# EAGLE design hover_controller_v2 (EAGLE 8.2.1)
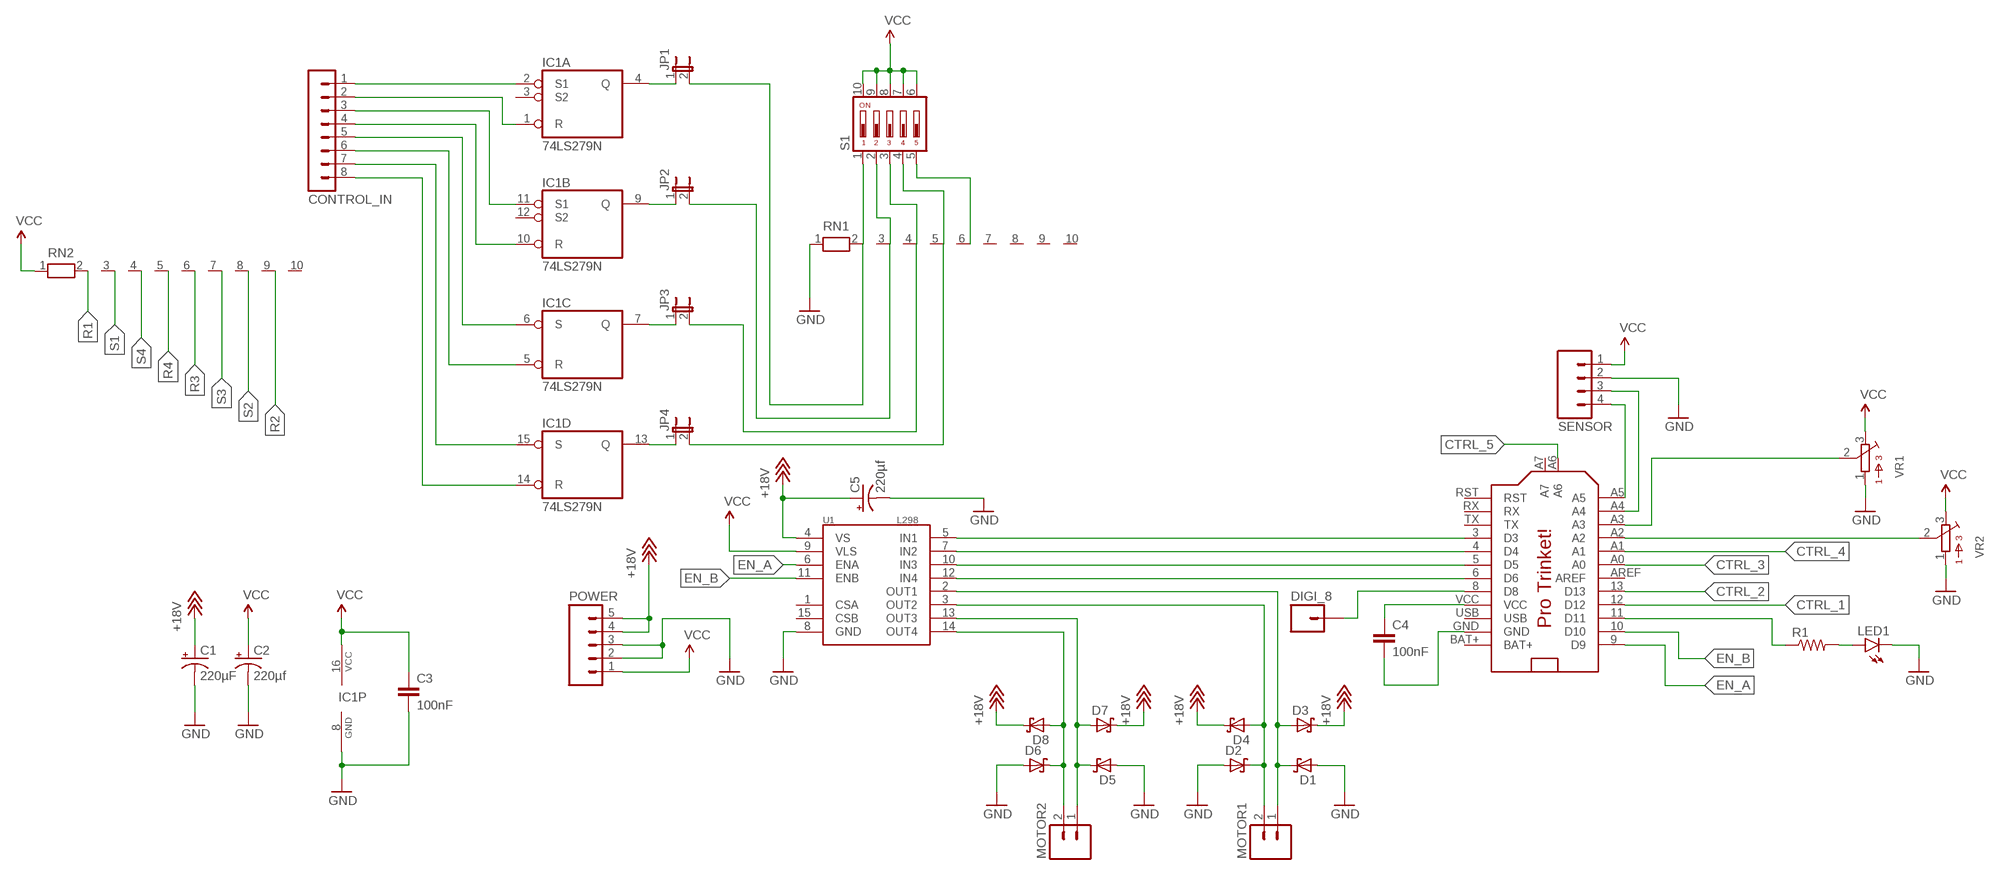
[diagram p0: schematic, sheet 1]

## Parts
C1  220µF  CAP_POLPTH2  [CPOL-RADIAL-10UF-25V]
C2  220µf  CAP_POLPTH2  [CPOL-RADIAL-10UF-25V]
C3  100nF  CAPPTH1  [CAP-PTH-5MM]
C4  100nF  CAPPTH1  [CAP-PTH-5MM]
C5  220µf  CAP_POLPTH2  [CPOL-RADIAL-10UF-25V]
CONTROL_IN  MA08-1  [MA08-1]
D1  SCHOTTKY-DIODEDO35-7  [DO35-7]
D2  SCHOTTKY-DIODEDO35-7  [DO35-7]
D3  SCHOTTKY-DIODEDO35-7  [DO35-7]
D4  SCHOTTKY-DIODEDO35-7  [DO35-7]
D5  SCHOTTKY-DIODEDO35-7  [DO35-7]
D6  SCHOTTKY-DIODEDO35-7  [DO35-7]
D7  SCHOTTKY-DIODEDO35-7  [DO35-7]
D8  SCHOTTKY-DIODEDO35-7  [DO35-7]
DIGI_8  M01PTH  [1X01]
IC1  74LS279N  [DIL16]
JP1  JUMPER-2PTH  [1X02]
JP2  JUMPER-2PTH  [1X02]
JP3  JUMPER-2PTH  [1X02]
JP4  JUMPER-2PTH  [1X02]
LED1  LED-3MM-NO_SILK  [LED3MM-NS]
MOTOR1  M02PTH  [1X02]
MOTOR2  M02PTH  [1X02]
POWER  M05JST-VERT  [JST-5-PTH-VERT]
R1  RESISTORPTH-1/4W  [AXIAL-0.4]
RN1  RN09  [RN-10]
RN2  RN09  [RN-10]
S1  DIP05YL  [DIP05YL]
SENSOR  M04PTH  [1X04]
U1  L298  [MULTIWATT15]
U$1  PRO_TRINKET  [PROTRINKET]
VR1  BOURNS_3362P_TRIMMERP  [BOURNS_3362P_TRIMMER]
VR2  BOURNS_3362P_TRIMMERP  [BOURNS_3362P_TRIMMER]

## Nets
+18V: C1.1(+) C5.1(+) D3.C D4.C D7.C D8.C POWER.4 POWER.5 U1.4(VS)
CTRL_1: JP1.2 RN1.2 S1.1 U$1.12(D12)
CTRL_2: JP2.2 RN1.3 S1.2 U$1.13(D13)
CTRL_3: JP3.2 RN1.4 S1.3 U$1.A0
CTRL_4: JP4.2 RN1.5 S1.4 U$1.A1
CTRL_5: RN1.6 S1.5 U$1.A6
EN_A: U1.6(ENA) U$1.9(D9)
EN_B: U1.11(ENB) U$1.10(D10)
GND: C1.2(-) C2.2(-) C3.2 C5.2(-) D1.A D2.A D5.A D6.A IC1.8(P:GND) LED1.K(C) POWER.2 POWER.3 RN1.1 SENSOR.2 U1.8(GND) VR1.1 VR2.1
N$1: IC1.4(A:Q) JP1.1
N$2: IC1.9(B:Q) JP2.1
N$3: IC1.7(C:Q) JP3.1
N$4: IC1.13(D:Q) JP4.1
N$5: U$1.A2 VR2.2
N$13: LED1.A R1.P$2
N$14: R1.P$1 U$1.11(D11)
N$15: DIGI_8.1 U$1.8(D8)
N$17: C4.1 U$1.VCC
N$18: U$1.A3 VR1.2
N$20: SENSOR.4 U$1.A5
N$21: SENSOR.3 U$1.A4
N$22: U1.5(IN1) U$1.3(D3)
N$23: U1.7(IN2) U$1.4(D4)
N$24: U1.10(IN3) U$1.5(D5)
N$25: U1.12(IN4) U$1.6(D6)
N$26: D1.C D3.A MOTOR1.1 U1.2(OUT1)
N$27: D2.C D4.A MOTOR1.2 U1.3(OUT2)
N$28: D5.C D7.A MOTOR2.1 U1.13(OUT3)
N$29: D6.C D8.A MOTOR2.2 U1.14(OUT4)
N$30: C4.2 U$1.GND
R1: CONTROL_IN.2 IC1.1(A:R) RN2.2
R2: CONTROL_IN.4 IC1.10(B:R) RN2.9
R3: CONTROL_IN.6 IC1.5(C:R) RN2.6
R4: CONTROL_IN.8 IC1.14(D:R) RN2.5
S1: CONTROL_IN.1 IC1.2(A:S1) RN2.3
S2: CONTROL_IN.3 IC1.11(B:S1) RN2.8
S3: CONTROL_IN.5 IC1.6(C:S) RN2.7
S4: CONTROL_IN.7 IC1.15(D:S) RN2.4
VCC: C2.1(+) C3.1 IC1.16(P:VCC) POWER.1 RN2.1 S1.6 S1.7 S1.8 S1.9 S1.10 SENSOR.1 U1.9(VLS) VR1.3 VR2.3
Unconnected: IC1.3(A:S2) IC1.12(B:S2) RN1.7 RN1.8 RN1.9 RN1.10 RN2.10 U1.1(CSA) U1.15(CSB) U$1.A7 U$1.AREF U$1.RST U$1.RX U$1.TX

## Power pins joined to a net without a drawn wire
BAT+: U$1.BAT+
USB: U$1.USB

## Library data of the parts
C1 C2 C5 = SparkFun-Capacitors:CAP_POL: Capacitor Polarized These are standard SMD and PTH capacitors. Normally 10uF, 47uF, and 100uF in electrolytic and tantalum varieties. Always verify the external diameter of the through hole cap, it varies with capacity, voltage, and manufacturer. The EIA devices should be standard.
C3 C4 = SparkFun-Capacitors:CAP: Capacitor Standard 0603 ceramic capacitor, and 0.1" leaded capacitor.
CONTROL_IN = con-lstb:MA08-1: PIN HEADER; OC_FARNELL: unknown; OC_NEWARK: unknown
D1-D8 = adafruit:SCHOTTKY-DIODE: Schottky Diode
DIGI_8 = SparkFun-Connectors:M01: Header 1 Standard 1-pin 0.1" header. Use with straight break away headers (SKU : PRT-00116), right angle break away headers (PRT-00553), swiss pins (PRT-00743), machine pins (PRT-00117), and female headers (PRT-00115).
IC1 = 74xx-us:74*279: Quadruple S-R LATCH
JP1-JP4 = SparkFun-Retired:JUMPER-2: Jumper Basic 0.1" spaced jumper. Use with breakaway headers.
LED1 = SparkFun-LED:LED: LEDs Standard schematic elements and footprints for 5mm, 3mm, 1206, and 0603 sized LEDs. 5mm - Spark Fun Electronics SKU : COM-00529 (and others)
MOTOR1 MOTOR2 = SparkFun-Connectors:M02: Standard 2-pin 0.1" header. Use with - straight break away headers ( PRT-00116) - right angle break away headers (PRT-00553) - swiss pins (PRT-00743) - machine pins (PRT-00117) - female headers (PRT-00115) Molex polarized connector foot print use with: PRT-08233 with associated crimp pins and housings. 2.54_SCREWTERM for use with PRT-10571. 3.5mm Screw Terminal footprints for PRT-08084 5mm Screw Terminal footprints for use with PRT-08432
POWER = SparkFun-Connectors:M05: Header 5 Standard 5-pin 0.1" header. Use with straight break away headers (SKU : PRT-00116), right angle break away headers (PRT-00553), swiss pins (PRT-00743), machine pins (PRT-00117), and female headers (PRT-00115). Molex polarized connector foot print use with SKU : PRT-08230 with associated crimp pins and housings.
R1 = SparkFun-Resistors:RESISTOR: Resistor Basic schematic elements and footprints for 0603, 1206, and PTH resistors.
RN1 RN2 = resistor-net:RN09: RESISTOR NETWORK; OC_FARNELL: unknown; OC_NEWARK: unknown
S1 = switch-dil:DIP05YL: DIL/CODE SWITCH; OC_FARNELL: unknown; OC_NEWARK: unknown
SENSOR = SparkFun-Connectors:M04: Header 4 Standard 4-pin 0.1" header. Use with straight break away headers (SKU : PRT-00116), right angle break away headers (PRT-00553), swiss pins (PRT-00743), machine pins (PRT-00117), and female headers (PRT-00115). Molex polarized connector foot print use with SKU : PRT-08231 with associated crimp pins and housings. 1MM SMD Version SKU: PRT-10208
U1 = SparkFun-PowerIC:L298: L298 Dual Full Bridge Driver
U$1 = adafruit:PRO_TRINKET
VR1 VR2 = MusicThingModular:BOURNS_3362P_TRIMMER: 3362 Series 1/4" Square Trimmer

## Board
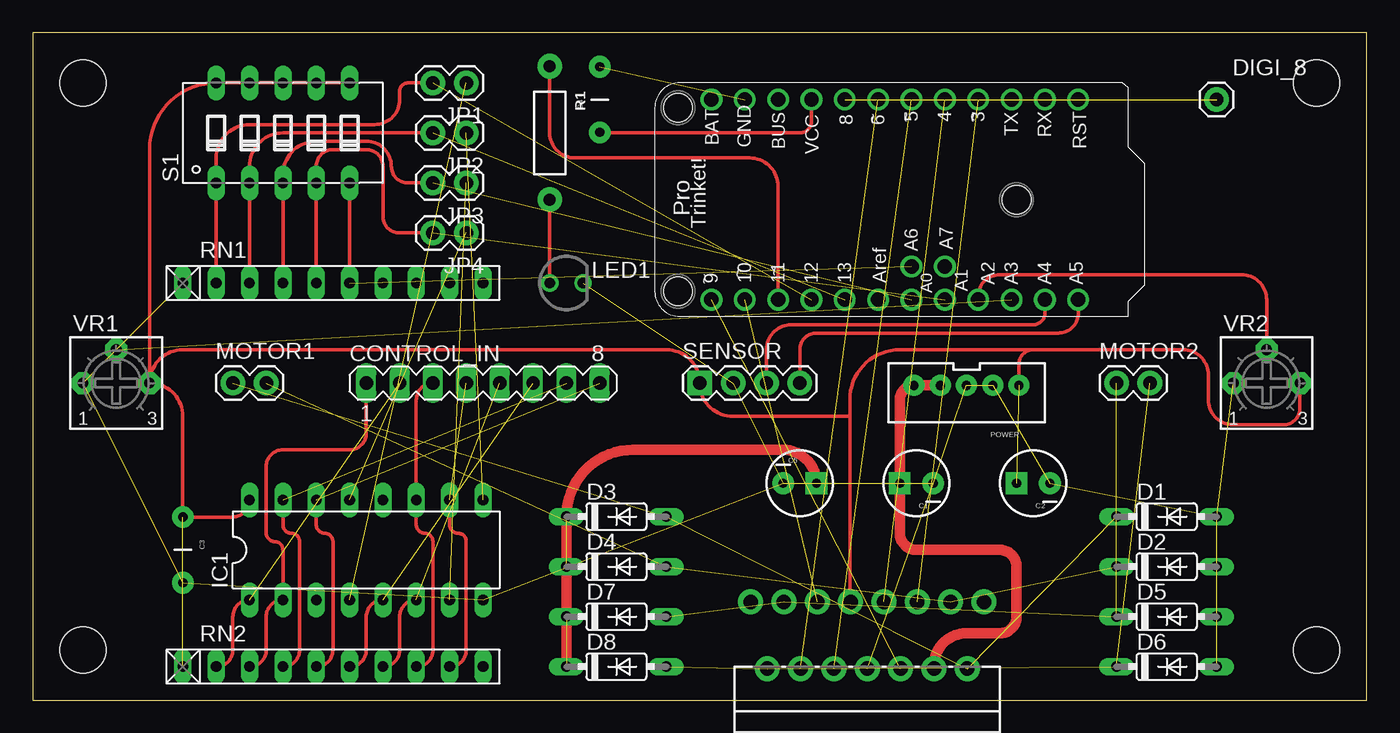
[diagram p1: board, top side]

Size 101.6 x 50.8 mm. Coordinates in mm from the lower left corner, seen from the top.
Outline: 0,0 101.6,0 101.6,50.8 0,50.8 0,0
Copper layers (1*16): Top 0.035mm / dielectric 1.5mm / Bottom 0.035mm
Design rules "default": minimum track width 6mil, minimum drill 0.35mm, track to track 6mil, track to pad 6mil, pad to pad 6mil, via to via 6mil, smd to smd 6mil, copper to edge 40mil, drill to drill 6mil, minimum pad ring 10mil, minimum via ring 8mil, stop-mask expansion 4mil, vias tented up to drill 0mil, thermal gap 10mil
Holes 3.5 mm at 3.81,46.99 3.81,3.81 97.79,3.81 97.79,46.99

### Footprints (pad centres in the part's own frame; a part is rotated, then mirrored left to right if it is on the bottom)
CPOL-RADIAL-10UF-25V = drill 0.7 pad 1.651 square: 1 1.27,0 | drill 0.7 pad 1.651: 2 -1.27,0
CAP-PTH-5MM = drill 0.7 pad 1.651: 1 -2.5,0; 2 2.5,0
MA08-1 = drill 1.016 long: 1 -8.89,0; 2 -6.35,0; 3 -3.81,0; 4 -1.27,0; 5 1.27,0; 6 3.81,0; 7 6.35,0; 8 8.89,0
DO35-7 = drill 0.813 long: A 3.81,0; C -3.81,0
1X01 = drill 1.016 pad 1.88: 1 0,0
DIL16 = drill 0.813 long: 1 -8.89,-3.81; 2 -6.35,-3.81; 3 -3.81,-3.81; 4 -1.27,-3.81; 5 1.27,-3.81; 6 3.81,-3.81; 7 6.35,-3.81; 8 8.89,-3.81; 9 8.89,3.81; 10 6.35,3.81; 11 3.81,3.81; 12 1.27,3.81; 13 -1.27,3.81; 14 -3.81,3.81; 15 -6.35,3.81; 16 -8.89,3.81
1X02 = drill 1.016 pad 1.88: 1 0,0; 2 2.54,0
LED3MM-NS = drill 0.813: A -1.27,0; K 1.27,0
JST-5-PTH-VERT = drill 0.7 pad 1.6: 1 -4,0.18; 2 -2,0.18; 3 0,0.18; 4 2,0.18; 5 4,0.18
AXIAL-0.4 = drill 0.9 pad 1.88: P$1 -5.08,0; P$2 5.08,0
RN-10 = drill 0.813 long: 1 -11.43,0; 2 -8.89,0; 3 -6.35,0; 4 -3.81,0; 5 -1.27,0; 6 1.27,0; 7 3.81,0; 8 6.35,0; 9 8.89,0; 10 11.43,0
DIP05YL = drill 0.813 long: 1 -5.08,-3.81; 2 -2.54,-3.81; 3 0,-3.81; 4 2.54,-3.81; 5 5.08,-3.81; 6 5.08,3.81; 7 2.54,3.81; 8 0,3.81; 9 -2.54,3.81; 10 -5.08,3.81
1X04 = drill 1.016 pad 1.88 square: 1 0,0 | drill 1.016 pad 1.88: 2 2.54,0; 3 5.08,0; 4 7.62,0
MULTIWATT15 = drill 1.1 pad 1.9: 1 -8.95,-2.39; 2 -7.68,2.69; 3 -6.41,-2.39; 4 -5.14,2.69; 5 -3.87,-2.39; 6 -2.6,2.69; 7 -1.33,-2.39; 8 -0.06,2.69; 9 1.21,-2.39; 10 2.48,2.69; 11 3.75,-2.39; 12 5.02,2.69; 13 6.29,-2.39; 14 7.56,2.69; 15 8.83,-2.39
PROTRINKET = drill 1.1: 3 7.62,2.921; 4 7.62,5.461; 5 7.62,8.001; 6 7.62,10.541; 8 7.62,13.081; 9 -7.62,23.241; 10 -7.62,20.701; 11 -7.62,18.161; 12 -7.62,15.621; 13 -7.62,13.081; A0 -7.62,8.001; A1 -7.62,5.461; A2 -7.62,2.921; A3 -7.62,0.381; A4 -7.62,-2.159; A5 -7.62,-4.699; A6 -5.08,8.001; A7 -5.08,5.461; AREF -7.62,10.541; BAT+ 7.62,23.241; GND 7.62,20.701; RST 7.62,-4.699; RX 7.62,-2.159; TX 7.62,0.381; USB 7.62,18.161; VCC 7.62,15.621 | hole 2.2: -6.985,25.781; 6.985,25.781; 0,0
BOURNS_3362P_TRIMMER = drill 0.813 pad 1.676 octagon: 1 -2.54,0; 2 0,2.54; 3 2.54,0

### Placement (x,y rotation side)
C1  67.31,16.51 180 top
C2  76.2,16.51 180 top
C3  11.43,11.43 270 top
C4  43.18,45.72 90 top
C5  58.42,16.51 0 top
CONTROL_IN  34.29,24.13 0 top
D1  86.36,13.97 0 top
D2  86.36,10.16 0 top
D3  44.45,13.97 0 top
D4  44.45,10.16 0 top
D5  86.36,6.35 0 top
D6  86.36,2.54 0 top
D7  44.45,6.35 0 top
D8  44.45,2.54 0 top
DIGI_8  90.17,45.72 0 top
IC1  25.4,11.43 0 top
JP1  33.02,46.99 180 top
JP2  33.02,43.18 180 top
JP3  33.02,39.37 180 top
JP4  33.02,35.56 180 top
LED1  40.64,31.75 0 top
MOTOR1  15.24,24.13 0 top
MOTOR2  82.55,24.13 0 top
POWER  71.12,24.13 180 top
R1  39.37,43.18 270 top
RN1  22.86,31.75 0 top
RN2  22.86,2.54 0 top
S1  19.05,43.18 0 top
SENSOR  50.8,24.13 0 top
U1  63.5,5.08 180 top
U$1  74.93,38.1 90 top
VR1  6.35,24.13 0 top
VR2  93.98,24.13 0 top

### Tracks (layer width: path | path; a pad name or v marks a point on that pad's centre or on a via)
+18V  (3 unrouted)
  Top 0.61: U1.4 68.64,2.6
  Top 0.813: D8.C D3.C arc-90 45.72,19.05 57.15,19.05 arc-90 C5.1 | POWER.4 POWER.5 arc90 66.04,22.87 C1.1 66.04,12.7 arc90 67.31,11.43 73.66,11.43 arc-90 74.93,10.16 74.93,6.35 arc-90 73.66,5.08 71.12,5.08 arc90 68.64,2.6
CTRL_1  (1 unrouted)
  Top 0.254: RN1.2 S1.1 13.97,41.27 arc-90 16.51,43.81 26.04,43.81 arc90 27.94,45.72 27.94,46.35 arc-90 28.57,46.99 JP1.2
CTRL_2  (1 unrouted)
  Top 0.254: RN1.3 S1.2 16.51,40.64 arc-90 19.05,43.18 JP2.2
CTRL_3  (1 unrouted)
  Top 0.254: RN1.4 S1.3 19.05,40.01 arc-90 21.59,42.55 25.4,42.55 arc-90 27.3,40.64 arc90 28.57,39.37 JP3.2
CTRL_4  (1 unrouted)
  Top 0.254: RN1.5 S1.4 21.59,40.64 arc-90 22.86,41.91 25.4,41.91 arc-90 26.67,40.64 26.67,36.83 arc90 27.94,35.56 JP4.2
CTRL_5  (1 unrouted)
  Top 0.254: RN1.6 S1.5
EN_A  (1 unrouted)
EN_B  (1 unrouted)
GND  (16 unrouted)
N$1  (1 unrouted)
N$2  (1 unrouted)
N$3  (1 unrouted)
N$4  (1 unrouted)
N$5
  Top 0.254: VR2.2 93.98,30.48 arc90 92.08,32.38 73.66,32.38 arc90 72.01,30.73 U$1.A2
N$13
  Top 0.254: R1.P$2 LED1.A
N$14
  Top 0.254: R1.P$1 39.37,43.18 arc90 41.27,41.27 54.61,41.27 arc-90 56.77,39.12 U$1.11
N$15  (1 unrouted)
N$17
  Top 0.254: C4.1 arc90 43.22,43.18 58.42,43.18 arc90 59.31,44.07 U$1.VCC
N$18  (1 unrouted)
N$20
  Top 0.254: SENSOR.4 58.42,26.67 arc-90 59.69,27.94 78.11,27.94 arc90 79.63,29.46 U$1.A5
N$21
  Top 0.254: SENSOR.3 55.88,26.67 arc-90 57.78,28.57 76.2,28.57 arc90 77.09,29.46 U$1.A4
N$22  (1 unrouted)
N$23  (1 unrouted)
N$24  (1 unrouted)
N$25  (1 unrouted)
N$26  (3 unrouted)
N$27  (3 unrouted)
N$28  (3 unrouted)
N$29  (3 unrouted)
N$30  (1 unrouted)
R1  (1 unrouted)
  Top 0.254: RN2.2 arc90 15.24,3.81 15.24,6.35 arc-90 IC1.1
R2  (1 unrouted)
  Top 0.254: RN2.9 arc90 33.02,3.81 33.02,12.06 arc90 32.38,12.7 arc-90 31.75,13.34 IC1.10
R3  (1 unrouted)
  Top 0.254: RN2.6 arc90 25.4,3.81 25.4,6.35 arc-90 IC1.5
R4  (1 unrouted)
  Top 0.254: RN2.5 arc90 22.86,3.81 22.86,12.06 arc90 22.23,12.7 arc-90 21.59,13.34 IC1.14
S1
  Top 0.254: RN2.3 arc90 17.78,3.81 17.78,6.35 arc-90 IC1.2 19.05,11.43 arc90 18.41,12.06 arc-90 17.78,12.7 17.78,17.78 arc-90 19.05,19.05 24.13,19.05 arc90 25.4,20.32 CONTROL_IN.1
S2
  Top 0.254: RN2.8 arc90 30.48,3.81 30.48,12.06 arc90 29.84,12.7 arc-90 29.21,13.34 IC1.11 29.21,22.86 arc-90 CONTROL_IN.3
S3  (1 unrouted)
  Top 0.254: RN2.7 arc90 27.94,3.81 27.94,6.35 arc-90 IC1.6
S4  (1 unrouted)
  Top 0.254: RN2.4 arc90 20.32,3.81 20.32,12.06 arc90 19.68,12.7 arc-90 19.05,13.34 IC1.15
VCC  (5 unrouted)
  Top 0.254: S1.6 S1.10 arc90 8.89,41.91 VR1.3 | 76.2,26.67 arc90 75.12,25.59 POWER.1 | VR2.3 96.52,22.23 arc-90 95.25,20.95 91.44,20.95 arc-90 89.53,22.86 89.53,24.77 arc90 87.63,26.67 76.2,26.67 | IC1.16 arc-90 15.2,13.93 C3.1 11.43,21.59 arc90 VR1.3 | U1.9 arc-90 62.23,7.53 62.23,21.59 | 62.23,21.59 62.23,22.86 arc-90 66.04,26.67 76.2,26.67 | 62.23,21.59 53.34,21.59 arc-90 SENSOR.1 arc90 48.26,26.67 11.43,26.67 arc90 VR1.3